# Altium schematic sheet TETHER_CONNECTOR.SchDoc
size A; SheetNumber: 2; SheetTotal: 6
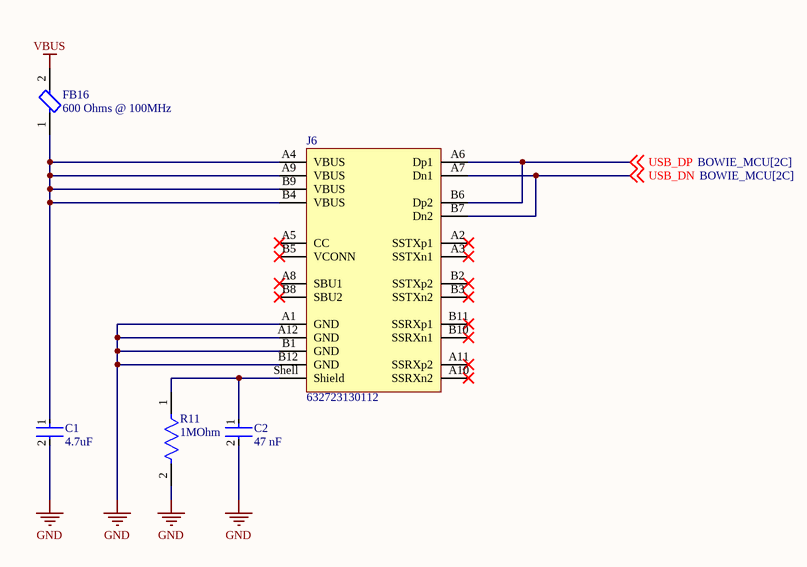
[diagram p0: TETHER_CONNECTOR.SchDoc]

## Parts
C1  4.7uF  [FP-CL828-IPC_C]
C2  47 nF  [FP-CC0402-MFG]
FB16  600 Ohms @ 100MHz  [FP-BLM15-0_05-MFG]
J6  632723130112  [632723130112]
R11  1MOhm  [FP-RMCF0402-MFG]

## Nets
GND: C1.2 C2.2 J6.A1(GND) J6.A12(GND) J6.B1(GND) J6.B12(GND) R11.2
VBUS: FB16.2
USB_DN: J6.A7(Dn1) J6.B7(Dn2) ; off-sheet USB_DN
USB_DP: J6.A6(Dp1) J6.B6(Dp2) ; off-sheet USB_DP
NetC1_1: C1.1 FB16.1 J6.A4(VBUS) J6.A9(VBUS) J6.B4(VBUS) J6.B9(VBUS)
NetC2_1: C2.1 J6.Shell(Shield) R11.1

Not connected (* = marked no-connect by the designer): J6 A2(SSTXp1)* A3(SSTXn1)* A5(CC)* A8(SBU1)* A10(SSRXn2)* A11(SSRXp2)* B2(SSTXp2)* B3(SSTXn2)* B5(VCONN)* B8(SBU2)* B10(SSRXn1)* B11(SSRXp1)*

## Library data of the parts
C1 = CMP-13271-001251-1: Cap Ceramic 4.7uF 10V X5R ±10% SMD 0402 +85°C Paper T/R; Height: 0.5mm; Mount: Surface Mount; Case Code (Metric): 1005; Case/Package: 0402; Capacitance: 4.7uF; Packaging: Tape and Reel; Dielectric: X5R; Radiation Hardening: No; Material: Ceramic; Thickness: 0.022inch; Min Operating Temperature: -55°C; Voltage Rating: 10V; Case Code (Imperial): 0402; Width: 0.02inch; Length: 1mm; Max Operating Temperature: 85°C; Lead Free: Lead Free; Tolerance: 10%; Package Quantity: 1; Depth: 0.5mm
C2 = CMP-03422-000813-1: CAP CER 0.047UF 25V X7R 0402; Manufacturer Part Number: CC0402KRX7R8BB473; Manufacturer: YAGEO; Automotive Grade: NA; Temperature Coefficient: 30ppm/°C; Material: Ceramic; Tolerance: 0.1; Temperature: -55°C to +125°C; Category: Cap; Voltage Rating: 25 V; Digikey Description: CAP CER 0.047UF 25V X7R 0402; Device Class L1: Passive Components; Device Class L3: Ceramic Capacitors; Ipc Land Pattern Name: CAPC10050X50; Value: 47 nF; Temperature Characteristic: X7R; Temperature Range High: +125°C; ComponentLink2URL: http://www.yageo.com/documents/recent/UPY-GP_NP0_16V-to-50V_16.pdf; Automotive: No; Temperature Range Low: -55°C; Package: CC0402; RoHS: TRUE; Height: 0.55mm; Device Class L2: Capacitors; Capacitance: 47 nF; Octopart: https://octopart.com/cc0402krx7r8bb473-yageo-22850998; Lead Free: Yes; Mouser Description: Multilayer Ceramic Capacitors MLCC - SMD/SMT 47nF 25V X7R 10%; Footprint Url: http://www.yageo.com/exep/pages/download/literatures/UPY-C_GEN_24.pdf; ComponentLink2Description: Datasheet
FB16 = CMP-0686-00252-4: Chip Ferrite Bead, 0402, 600Ω @ 100MHz, 0.23Ω, 25%, 900mA; Number of Circuits: 1; Impedance: 600R; DC Resistance (DCR): 230mR; Material: Steel; Length: 1mm; Package Quantity: 10000; Height: 0.5mm; Width: 0.5mm; Max DC Current: 900mA; Number of Lines: 1; Termination: SMD/SMT; Packaging: Tape and Reel; Lead Free: Lead Free; Min Operating Temperature: -55°C; Max Operating Temperature: 125°C; Max Current Rating: 900mA; Case Code (Imperial): 0402; Number of Pins: 2; Current Rating: 900mA; Test Frequency: 100MHz; Case/Package: 0402; Tolerance: 25%; Case Code (Metric): 1005
J6 = CMP-207978-000001-2: WR-COM_USB 3.1_TYPE C_HORIZONTAL; NexarPartId: 99674471; Insulation Resistance: 100MΩ; USB Standard: USB 3.1; Number of Contacts: 24; Current Rating: 5A; Voltage Rating: 20V; Gender: Receptacle; Max Operating Temperature: 85°C; Height: 3.52mm; Min Operating Temperature: -40°C; Number of Pins: 24; Contact Material: Gold, Nickel; Packaging: Tape and Reel; RoHS: Compliant
R11 = CMP-2000-06985-2: 1MΩ ±1% 0.063W 0402 Thick Film Chip Resistor AEC-Q200 compliant; Max Power Dissipation: 63mW; Resistance: 1MR; Power Rating: 62.5mW; Temperature Coefficient: 100ppm/°C; Resistor Type: Thick Film; Military Standard: Not; Packaging: Tape and Reel; Radiation Hardening: No; Construction: Rectangular; Length: 1mm; Case/Package: 0402; Width: 0.02inch; Case Code (Imperial): 0402; Lead Free: Lead Free; Number of Terminations: 2; Min Operating Temperature: -55°C; Height: 0.016inch; Tolerance: 1%; Contact Plating: Tin; Case Code (Metric): 1005; Depth: 0.5mm; Features: Automotive AEC-Q200; Max Operating Temperature: 155°C; Size Code: 0402; Mount: Surface Mount; RoHS Compliant: Yes; Series: RMCF